# Altium schematic sheet Main_STM32F4.SchDoc
size A; SheetNumber: 1; SheetTotal: 3
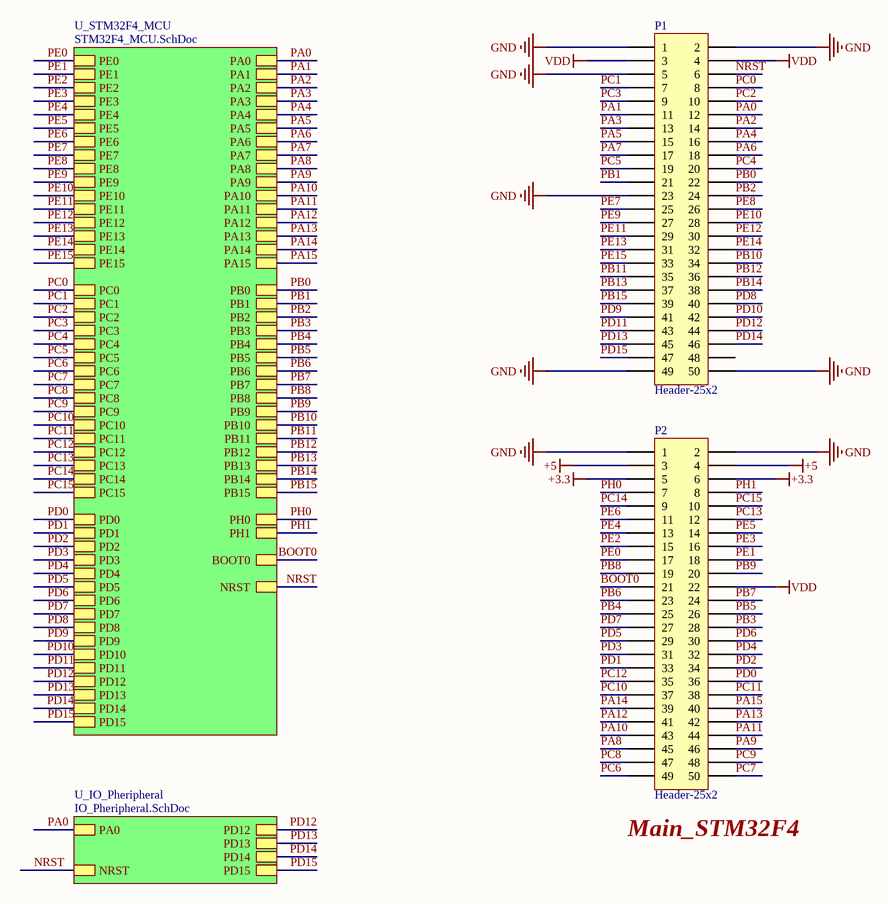
[diagram p0: Main_STM32F4.SchDoc]

## Parts
P1  Header-25x2  [Header-25x2]
P2  Header-25x2  [Header-25x2]

## Sub-sheets
U_IO_Pheripheral = IO_Pheripheral.SchDoc: PA0, NRST, PD12, PD13, PD14, PD15
U_STM32F4_MCU = STM32F4_MCU.SchDoc: PE0, PC0, PD0, PA0, PB0, NRST, BOOT0, PE1, PE2, PE3, PE4, PE5, PE6, PE7, PE8, PE9, PE10, PE11, PE12, PE13, PE14, PE15, PC1, PC2, PC3, PC4, PC5, PC6, PC7, PC8, PC9, PC10, PC11, PC12, PC13, PC14, PC15, PD1, PD2, PD3, PD4, PD5, PD6, PD7, PD8, PD9, PD10, PD11, PD12, PD13, PD14, PD15, PA1, PA2, PA3, PA4, PA5, PA6, PA7, PA8, PA9, PA10, PA11, PA12, PA13, PA14, PA15, PB1, PB2, PB3, PB4, PB5, PB6, PB7, PB8, PB9, PB10, PB11, PB12, PB13, PB14, PB15, PH0, PH1

## Nets
+3.3: P2.5 P2.6
+5: P2.3 P2.4
GND: P1.1 P1.2 P1.5 P1.23 P1.49 P1.50 P2.1 P2.2
VDD: P1.3 P1.4 P2.22
BOOT0: P2.21 ; sheet U_STM32F4_MCU/BOOT0
NRST: P1.6 ; sheet U_IO_Pheripheral/NRST, sheet U_STM32F4_MCU/NRST
PA0: P1.12 ; sheet U_IO_Pheripheral/PA0, sheet U_STM32F4_MCU/PA0
PA1: P1.11 ; sheet U_STM32F4_MCU/PA1
PA2: P1.14 ; sheet U_STM32F4_MCU/PA2
PA3: P1.13 ; sheet U_STM32F4_MCU/PA3
PA4: P1.16 ; sheet U_STM32F4_MCU/PA4
PA5: P1.15 ; sheet U_STM32F4_MCU/PA5
PA6: P1.18 ; sheet U_STM32F4_MCU/PA6
PA7: P1.17 ; sheet U_STM32F4_MCU/PA7
PA8: P2.45 ; sheet U_STM32F4_MCU/PA8
PA9: P2.46 ; sheet U_STM32F4_MCU/PA9
PA10: P2.43 ; sheet U_STM32F4_MCU/PA10
PA11: P2.44 ; sheet U_STM32F4_MCU/PA11
PA12: P2.41 ; sheet U_STM32F4_MCU/PA12
PA13: P2.42 ; sheet U_STM32F4_MCU/PA13
PA14: P2.39 ; sheet U_STM32F4_MCU/PA14
PA15: P2.40 ; sheet U_STM32F4_MCU/PA15
PB0: P1.22 ; sheet U_STM32F4_MCU/PB0
PB1: P1.21 ; sheet U_STM32F4_MCU/PB1
PB2: P1.24 ; sheet U_STM32F4_MCU/PB2
PB3: P2.28 ; sheet U_STM32F4_MCU/PB3
PB4: P2.25 ; sheet U_STM32F4_MCU/PB4
PB5: P2.26 ; sheet U_STM32F4_MCU/PB5
PB6: P2.23 ; sheet U_STM32F4_MCU/PB6
PB7: P2.24 ; sheet U_STM32F4_MCU/PB7
PB8: P2.19 ; sheet U_STM32F4_MCU/PB8
PB9: P2.20 ; sheet U_STM32F4_MCU/PB9
PB10: P1.34 ; sheet U_STM32F4_MCU/PB10
PB11: P1.35 ; sheet U_STM32F4_MCU/PB11
PB12: P1.36 ; sheet U_STM32F4_MCU/PB12
PB13: P1.37 ; sheet U_STM32F4_MCU/PB13
PB14: P1.38 ; sheet U_STM32F4_MCU/PB14
PB15: P1.39 ; sheet U_STM32F4_MCU/PB15
PC0: P1.8 ; sheet U_STM32F4_MCU/PC0
PC1: P1.7 ; sheet U_STM32F4_MCU/PC1
PC2: P1.10 ; sheet U_STM32F4_MCU/PC2
PC3: P1.9 ; sheet U_STM32F4_MCU/PC3
PC4: P1.20 ; sheet U_STM32F4_MCU/PC4
PC5: P1.19 ; sheet U_STM32F4_MCU/PC5
PC6: P2.49 ; sheet U_STM32F4_MCU/PC6
PC7: P2.50 ; sheet U_STM32F4_MCU/PC7
PC8: P2.47 ; sheet U_STM32F4_MCU/PC8
PC9: P2.48 ; sheet U_STM32F4_MCU/PC9
PC10: P2.37 ; sheet U_STM32F4_MCU/PC10
PC11: P2.38 ; sheet U_STM32F4_MCU/PC11
PC12: P2.35 ; sheet U_STM32F4_MCU/PC12
PC13: P2.12 ; sheet U_STM32F4_MCU/PC13
PC14: P2.9 ; sheet U_STM32F4_MCU/PC14
PC15: P2.10 ; sheet U_STM32F4_MCU/PC15
PD0: P2.36 ; sheet U_STM32F4_MCU/PD0
PD1: P2.33 ; sheet U_STM32F4_MCU/PD1
PD2: P2.34 ; sheet U_STM32F4_MCU/PD2
PD3: P2.31 ; sheet U_STM32F4_MCU/PD3
PD4: P2.32 ; sheet U_STM32F4_MCU/PD4
PD5: P2.29 ; sheet U_STM32F4_MCU/PD5
PD6: P2.30 ; sheet U_STM32F4_MCU/PD6
PD7: P2.27 ; sheet U_STM32F4_MCU/PD7
PD8: P1.40 ; sheet U_STM32F4_MCU/PD8
PD9: P1.41 ; sheet U_STM32F4_MCU/PD9
PD10: P1.42 ; sheet U_STM32F4_MCU/PD10
PD11: P1.43 ; sheet U_STM32F4_MCU/PD11
PD12: P1.44 ; sheet U_IO_Pheripheral/PD12, sheet U_STM32F4_MCU/PD12
PD13: P1.45 ; sheet U_IO_Pheripheral/PD13, sheet U_STM32F4_MCU/PD13
PD14: P1.46 ; sheet U_IO_Pheripheral/PD14, sheet U_STM32F4_MCU/PD14
PD15: P1.47 ; sheet U_IO_Pheripheral/PD15, sheet U_STM32F4_MCU/PD15
PE0: P2.17 ; sheet U_STM32F4_MCU/PE0
PE1: P2.18 ; sheet U_STM32F4_MCU/PE1
PE2: P2.15 ; sheet U_STM32F4_MCU/PE2
PE3: P2.16 ; sheet U_STM32F4_MCU/PE3
PE4: P2.13 ; sheet U_STM32F4_MCU/PE4
PE5: P2.14 ; sheet U_STM32F4_MCU/PE5
PE6: P2.11 ; sheet U_STM32F4_MCU/PE6
PE7: P1.25 ; sheet U_STM32F4_MCU/PE7
PE8: P1.26 ; sheet U_STM32F4_MCU/PE8
PE9: P1.27 ; sheet U_STM32F4_MCU/PE9
PE10: P1.28 ; sheet U_STM32F4_MCU/PE10
PE11: P1.29 ; sheet U_STM32F4_MCU/PE11
PE12: P1.30 ; sheet U_STM32F4_MCU/PE12
PE13: P1.31 ; sheet U_STM32F4_MCU/PE13
PE14: P1.32 ; sheet U_STM32F4_MCU/PE14
PE15: P1.33 ; sheet U_STM32F4_MCU/PE15
PH0: P2.7 ; sheet U_STM32F4_MCU/PH0
PH1: P2.8 ; sheet U_STM32F4_MCU/PH1

Not connected (* = marked no-connect by the designer): P1 48

## Notes on the sheet
- (near P2) Main_STM32F4

## Library data of the parts
P1 P2 = Header-25x2: Header 8x2 pins